# EAGLE design AC-DC 3.3 Volt Power Supply (EAGLE 6.3)
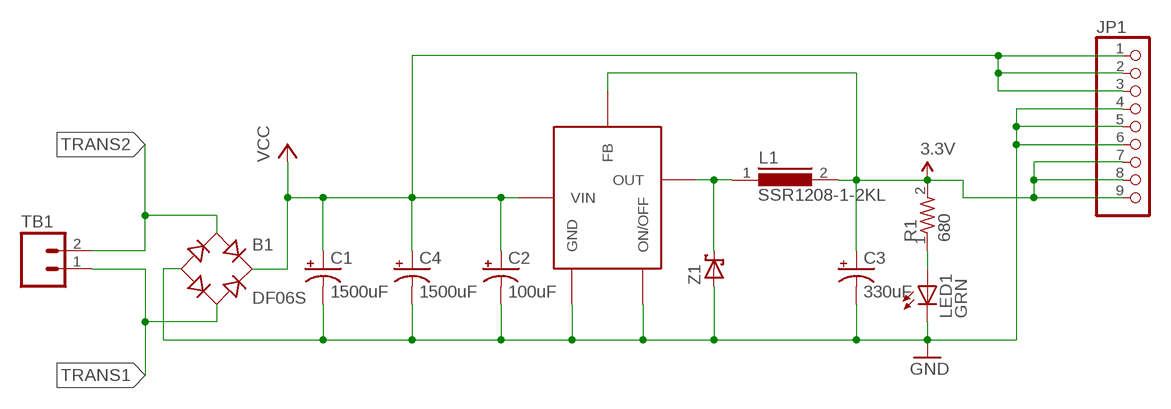
[diagram p0: schematic, sheet 1]

## Parts
B1  DF06S  [DFS]
C1  1500uF  CAP_POL_J16  [CAP_J16]
C2  100uF  CAP_POL_F  [CAP_F]
C3  330uF  CAP_POL_F  [CAP_F]
C4  1500uF  CAP_POL_J16  [CAP_J16]
JP1  PINHD-1X9  [1X09]
L1  SSR1208-1-2KL  DR125  [DR125]
LED1  GRN  LEDCHIP-LED0603  [CHIP-LED0603]
R1  680  0603_RESISTOR  [0603_RESISTOR]
REG1  TL2575  [TO-263-6]
TB1  TERMINAL_BLOCK_2  [TERMINL_BLOCK_2_POS]
Z1  SCHOTTKY_DIODE  [DIODE_SMB]

## Nets
3.3V: C3.+ JP1.7 JP1.8 JP1.9 L1.2 R1.2 REG1.4(FB)
GND: B1.- C1.1(-) C2.- C3.- C4.1(-) JP1.4 JP1.5 JP1.6 LED1.C REG1.3(GND) REG1.5(ON/OFF) Z1.A
N$1: LED1.A R1.1
N$8: L1.1 REG1.2(OUT) Z1.C
TRANS1: B1.AC2 TB1.1
TRANS2: B1.AC1 TB1.2
VCC: B1.+ C1.2(+) C2.+ C4.2(+) JP1.1 JP1.2 JP1.3 REG1.1(VIN)

## Library data of the parts
B1 = rectifier:DF*S: Surface Mount Glass Passivated Bridge Rectifiers Source: Source: Comchip Bridge Rectifiers DF005S-G thru DF10S-G.pdf
C1 C4 = jkf-parts:CAP_POL_J16: POL J16 SMT CAP
C2 C3 = jkf-parts:CAP_POL_F: Panasonic Size F Capacitor
JP1 = pinhead:PINHD-1X9: PIN HEADER
L1 = inductors:DR125: High Power Density, High Efficiency, Shielded Inductors Source: coiltronics_dr_series.pdf
LED1 = adafruit:LED: LED OSRAM: - CHIPLED LG R971, LG N971, LY N971, LG Q971, LY Q971, LO R971, LY R971 LH N974, LH R974 LS Q976, LO Q976, LY Q976 LO Q996 - Hyper CHIPLED LW Q18S LB Q993, LB Q99A, LB R99A - SideLED LS A670, LO A670, LY A670, LG A670, LP A670 LB A673, LV A673, LT A673, LW A673 LH A674 LY A675 LS A676, LA A676, LO A676, LY A676, LW A676 LS A679, LY A679, LG A679 - Hyper Micro SIDELED® LS Y876, LA Y876, LO Y876, LY Y876 LT Y87S - SmartLED LW L88C, LW L88S LB L89C, LB L89S, LG L890 LS L89K, LO L89K, LY L89K LS L896, LA L896, LO L896, LY L896 - TOPLED LS T670, LO T670, LY T670, LG T670, LP T670 LSG T670, LSP T670, LSY T670, LOP T670, LYG T670 LG T671, LOG T671, LSG T671 LB T673, LV T673, LT T673, LW T673 LH T674 LS T676, LA T676, LO T676, LY T676, LB T676, LH T676, LSB T676, LW T676 LB T67C, LV T67C, LT T67C, LS T67K, LO T67K, LY T67K, LW E67C LS E67B, LA E67B, LO E67B, LY E67B, LB E67C, LV E67C, LT E67C LW T67C LS T679, LY T679, LG T679 LS T770, LO T770, LY T770, LG T770, LP T770 LB T773, LV T773, LT T773, LW T773 LH T774 LS E675, LA E675, LY E675, LS T675 LS T776, LA T776, LO T776, LY T776, LB T776 LHGB T686 LT T68C, LB T68C - Hyper Mini TOPLED® LB M676 - Mini TOPLED Santana® LG M470 LS M47K, LO M47K, LY M47K Source: http://www.osram.convergy.de/
R1 = jkf-parts:0603_RESISTOR
REG1 = jkf-parts:TL2575: 3.3 Volt Switching Regulator
TB1 = jkf-parts:TERMINAL_BLOCK_2: Terminal Block 2 position
Z1 = jkf-parts:SCHOTTKY_DIODE: 1A Schottky Diode

## Net classes
0 default: clearance 0.254 mm

## Board
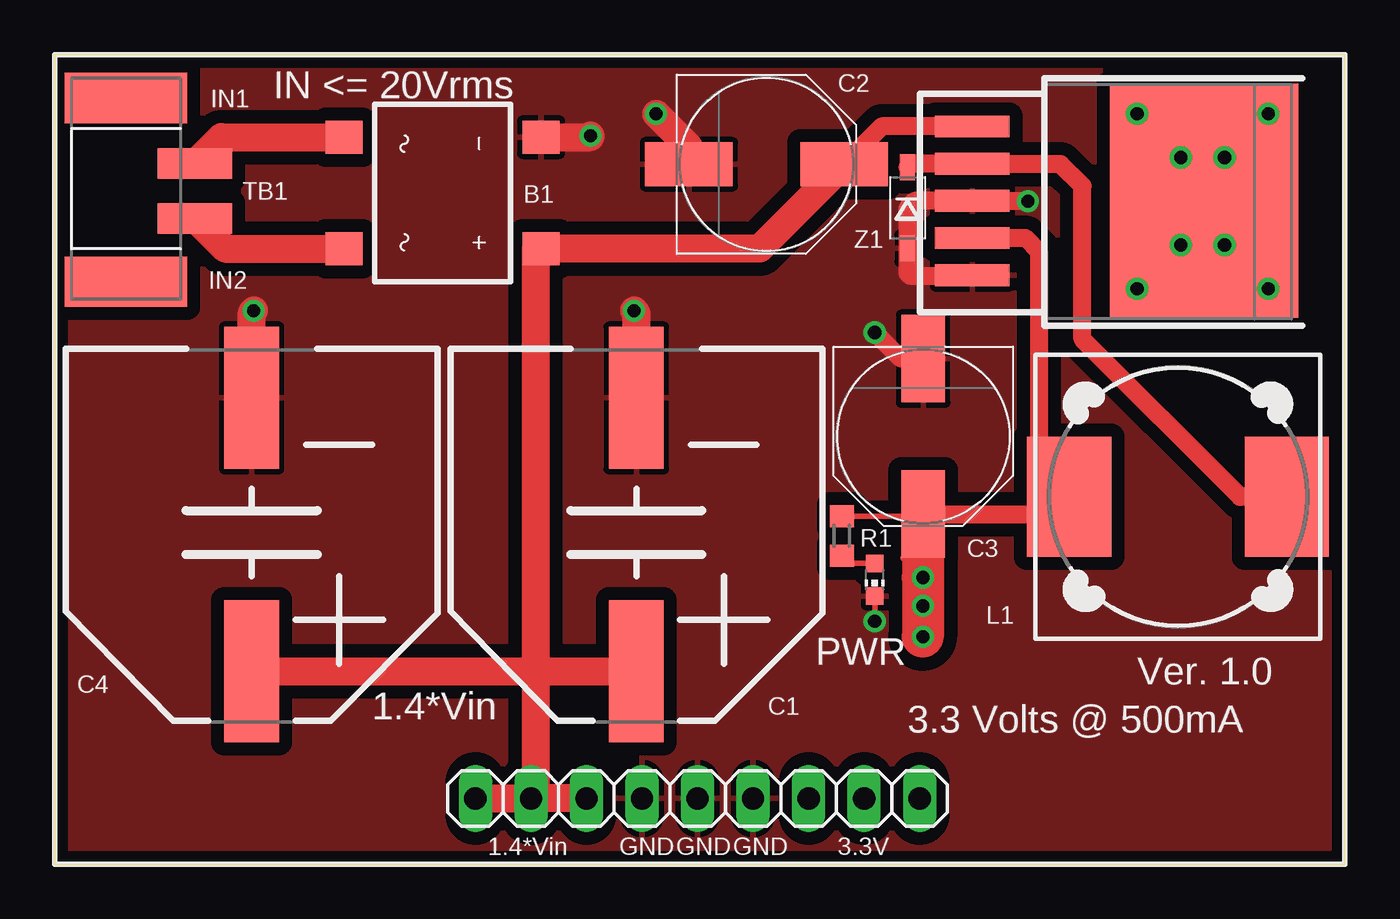
[diagram p1: board, top side]
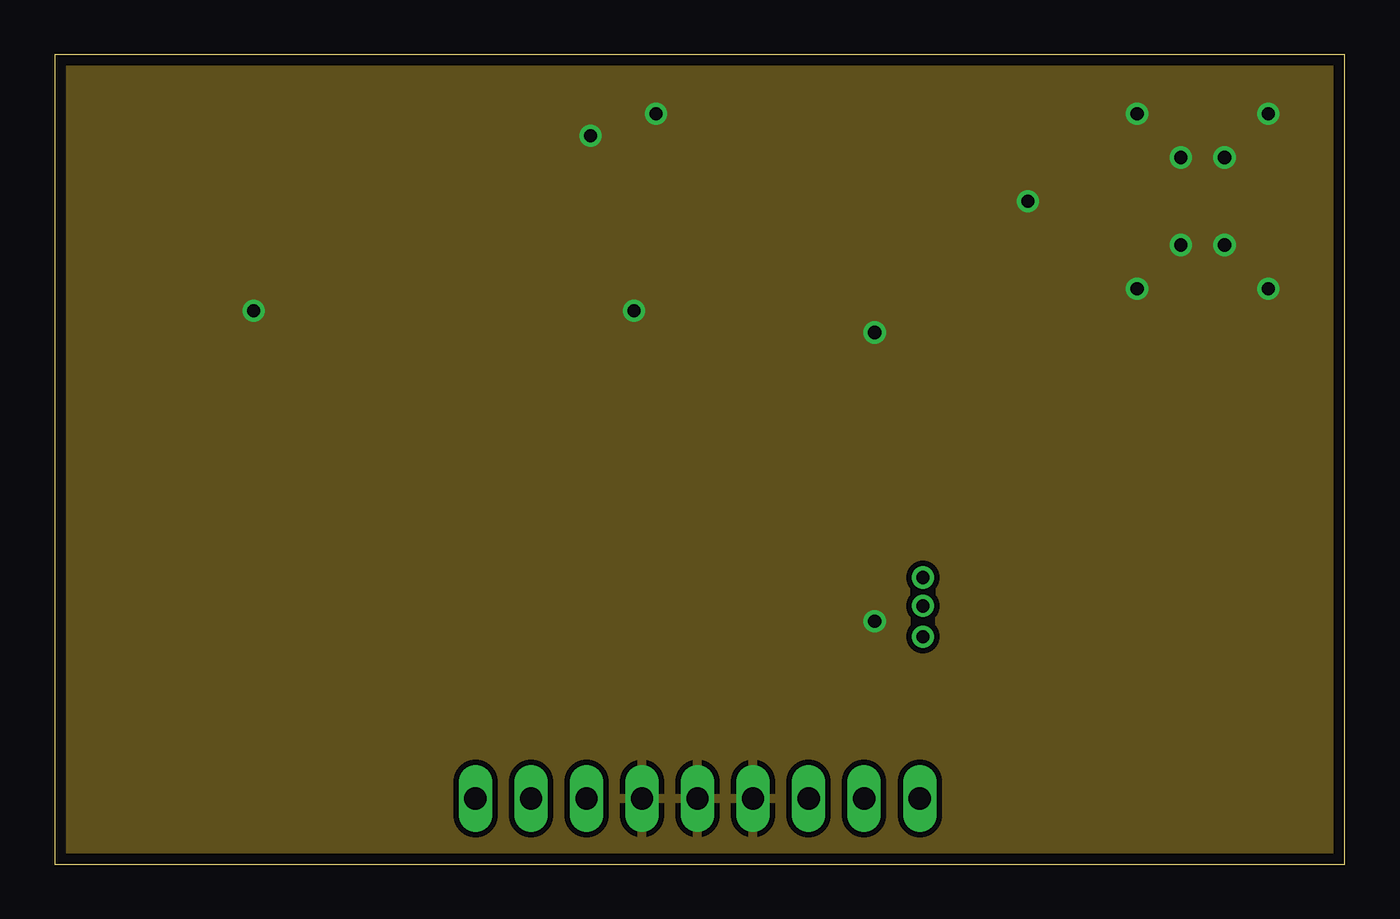
[diagram p2: board, inner layer GND]
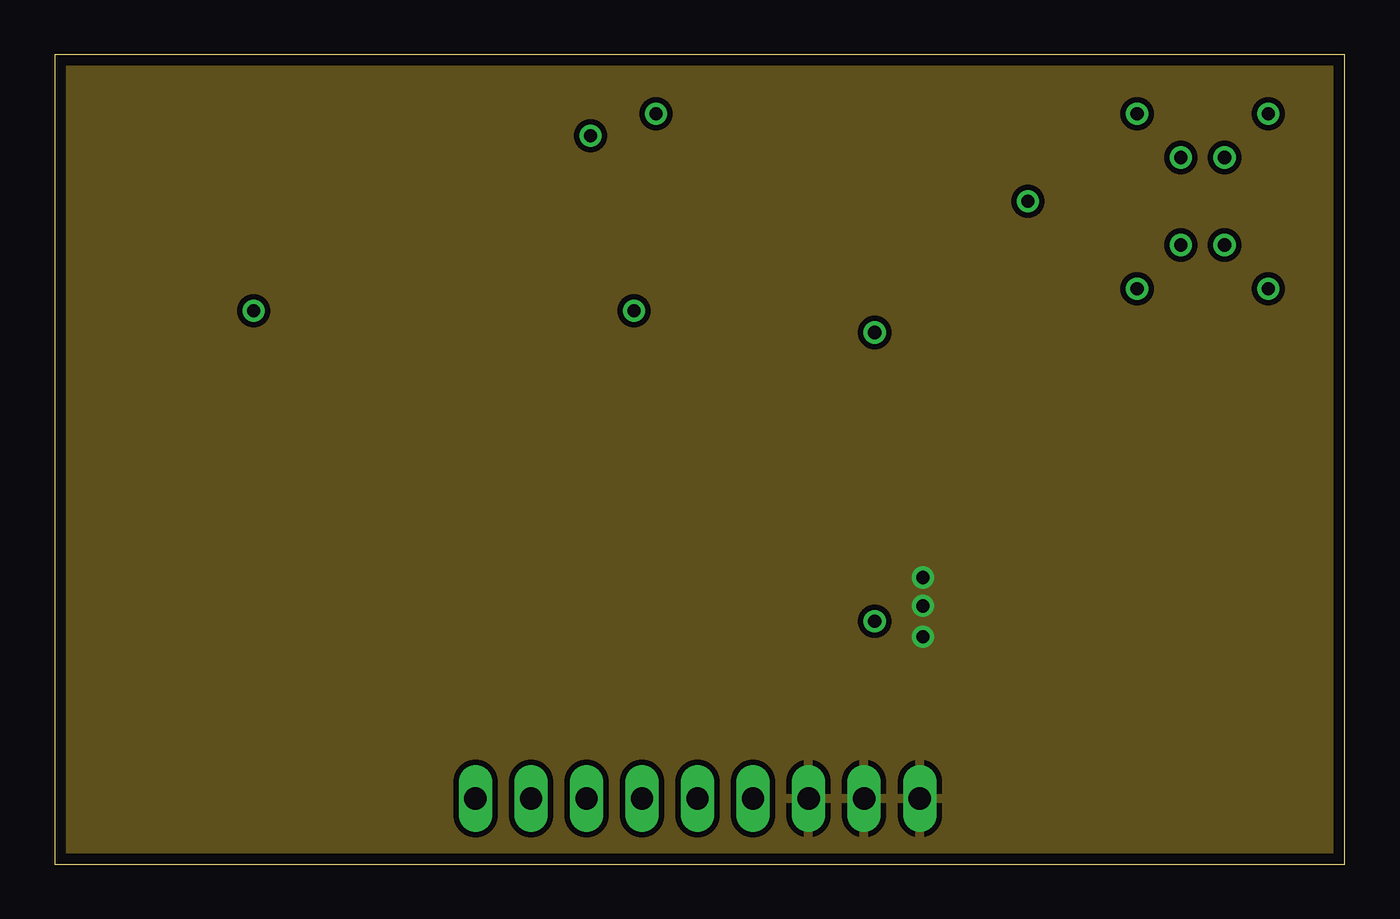
[diagram p3: board, inner layer 3.3V]
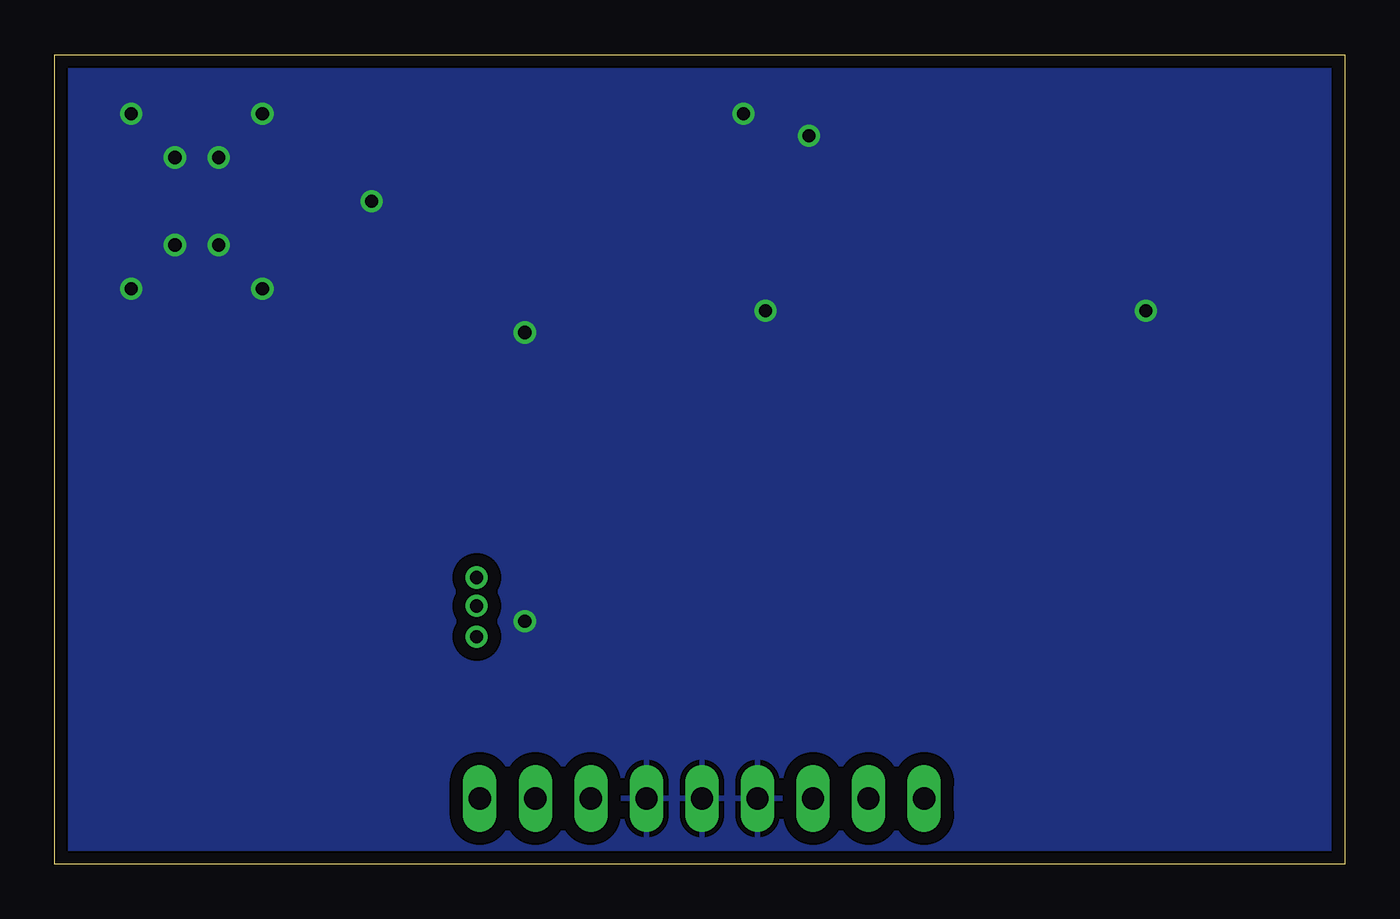
[diagram p4: board, bottom side, seen from below]

Size 59 x 37 mm. Coordinates in mm from the lower left corner, seen from the top.
Outline: 0,0 59,0 59,37 0,37 0,0
Copper layers (1+2*15+16): Top 0.0178mm / dielectric 12mil / GND 0.0356mm / dielectric 28mil / 3.3V 0.0356mm / dielectric 12mil / Bottom 0.0178mm
Design rules "SSC-EAGLE-4Lyr_v1.0.0.3": minimum track width 6mil, minimum drill 8mil, track to track 6mil, track to pad 6mil, pad to pad 6mil, via to via 6mil, smd to smd 6mil, copper to edge 20mil, drill to drill 16mil, minimum pad ring 8mil, minimum via ring 8mil, stop-mask expansion 3mil, vias tented up to drill 0mil, thermal gap 10mil

### Footprints (pad centres in the part's own frame; a part is rotated, then mirrored left to right if it is on the bottom)
DFS = smd 1.5 x 1.7: + -2.55,-4.5; - 2.55,-4.5; AC1 -2.55,4.5; AC2 2.55,4.5
CAP_J16 = smd 2.5 x 6.5: 1 0,6.15; 2 0,-6.35
CAP_F = smd 4 x 2: + 3.55,0; - -3.55,0
1X09 = drill 1.016 long: 1 -10.16,0; 2 -7.62,0; 3 -5.08,0; 4 -2.54,0; 5 0,0; 6 2.54,0; 7 5.08,0; 8 7.62,0; 9 10.16,0
DR125 = smd 3.85 x 5.5: 1 -4.975,0; 2 4.975,0
CHIP-LED0603 = smd 0.8 x 0.8: A 0,-0.75; C 0,0.75
0603_RESISTOR = smd 1 x 1.1: 1 -0.9,0; 2 0.9,0
TO-263-6 = smd 1 x 3.4: 1 -3.4,-10.6; 2 -1.7,-10.6; 3 0,-10.6; 4 1.7,-10.6; 5 3.4,-10.6 | smd 10.7 x 8.6: P$1 0,0
TERMINL_BLOCK_2_POS = smd 1.4 x 3.4: 1 -1,3.15; 2 1.5,3.15 | smd 2.3 x 5.6: P$1 -4,0; P$2 4.4,0
DIODE_SMB = smd 1.2 x 0.7: A 1.85,0; C -1.85,0

### Placement (x,y rotation side)
B1  17.74,30.68 90 top
C1  26.6,15.16 0 top
C2  32.55,31.99 0 top
C3  39.72,19.55 270 top
C4  9.01,15.16 0 top
JP1  29.4,3 0 top
L1  51.37,16.79 180 top
LED1  37.5,13 180 top
R1  36,15 90 top
REG1  52.56,30.32 270 top
TB1  3.26,31.02 270 top
Z1  39,30 270 top

### Tracks (layer width: path | path; a pad name or v marks a point on that pad's centre or on a via)
3.3V  (via drill 0.6)
  Top 0.254: 38.8,14 v39.7,13.1 | R1.2 39.62,15.9 C3.+
  Top 0.813: C3.+ 45.6,16 L1.2 45,18.18 45,28 44.38,28.62 REG1.4
  Top 1.93: C3.+ 39.7,16 v39.7,13.1 v39.7,10.4
  other vias: 39.7,11.8
  pour 3.3V: -1,38 60,38 60,-1 -1,-1
GND  (via drill 0.6)
  Top 0.254: LED1.C v37.5,11.1
  Top 0.813: v44.5,30.3 44.5,30.32 REG1.3 39.32,30.32 39,30 Z1.A 39,27 39.1,26.9 41.94,26.9 REG1.5 | C3.- 38.7,23.1 v37.5,24.3
  Top 1.27: C4.1 9.01,25.21 v9.1,25.3 | C1.1 26.6,25.2 v26.5,25.3 | C2.- 29,32.8 v27.5,34.3 | B1.- 24.5,33.23 v24.5,33.3
  other vias: 49.5,34.3 49.5,26.3 55.5,26.3 55.5,34.3 51.5,32.3 51.5,28.3 53.5,28.3 53.5,32.3
  pour GND: -1,38 60,38 60,-1 -1,-1
  pour Top (isolate 0.61): 0,37 59,37 59,0 0,0
  pour Bottom (isolate 0.61): 0,37 59,37 59,0 0,0
N$1
  Top 0.254: R1.1 36.35,13.75 LED1.A
N$8
  Top 0.813: L1.1 54.21,16.79 47,24 47,31 46,32 41.98,32 REG1.2 39.15,32.02 39,31.87 Z1.C
TRANS1
  Top 1.27: TB1.1 7.62,33.23 B1.AC2
TRANS2
  Top 1.27: TB1.2 7.8,28.13 B1.AC1
VCC
  Top 0.813: REG1.1 37.83,33.72 C2.+
  Top 1.27: C4.2 22,8.81 | 22,8.81 C1.2 | C2.+ 32.24,28.13 B1.+ 22,28.13 22,8.81 | 22,8.81 22,3.22 JP1.2 | JP1.1 JP1.2 | JP1.3 JP1.2

### Text on the board
tPlace: IN1 | IN <= 20Vrms | IN2 | PWR
tSilk: Ver. 1.0 | 1.4*Vin | 3.3 Volts @ 500mA | 1.4*Vin | GND | GND | GND | 3.3V